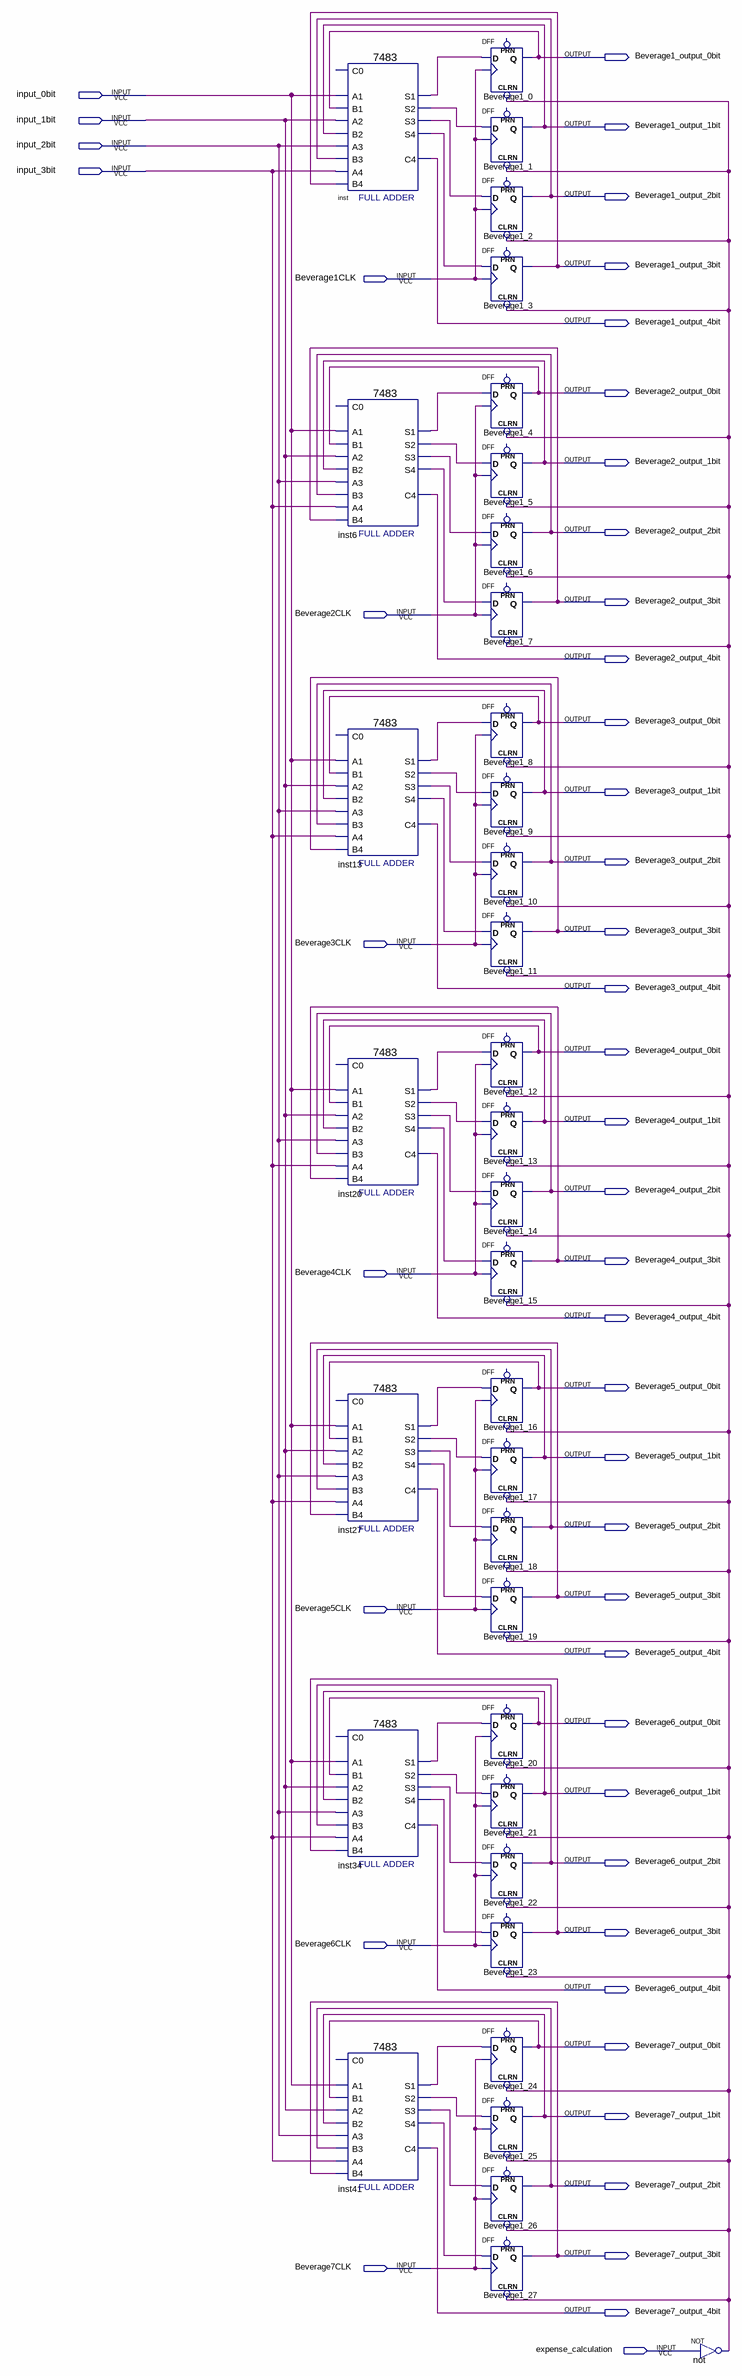
[diagram p0: schematic sheet]
// Quartus schematic DFF_select_Beverage.bdf as structural Verilog: 36 symbols, 47 pins
module DFF_select_Beverage (
  input  input_0bit,
  input  input_1bit,
  input  input_2bit,
  input  input_3bit,
  input  Beverage1CLK,
  input  Beverage2CLK,
  input  Beverage3CLK,
  input  Beverage4CLK,
  input  Beverage5CLK,
  input  Beverage6CLK,
  input  Beverage7CLK,
  input  expense_calculation,
  output Beverage1_output_0bit,
  output Beverage1_output_1bit,
  output Beverage1_output_2bit,
  output Beverage1_output_3bit,
  output Beverage1_output_4bit,
  output Beverage2_output_0bit,
  output Beverage2_output_1bit,
  output Beverage2_output_2bit,
  output Beverage2_output_3bit,
  output Beverage2_output_4bit,
  output Beverage3_output_0bit,
  output Beverage3_output_1bit,
  output Beverage3_output_2bit,
  output Beverage3_output_3bit,
  output Beverage3_output_4bit,
  output Beverage4_output_0bit,
  output Beverage4_output_1bit,
  output Beverage4_output_2bit,
  output Beverage4_output_3bit,
  output Beverage4_output_4bit,
  output Beverage5_output_0bit,
  output Beverage5_output_1bit,
  output Beverage5_output_2bit,
  output Beverage5_output_3bit,
  output Beverage5_output_4bit,
  output Beverage6_output_0bit,
  output Beverage6_output_1bit,
  output Beverage6_output_2bit,
  output Beverage6_output_3bit,
  output Beverage6_output_4bit,
  output Beverage7_output_0bit,
  output Beverage7_output_1bit,
  output Beverage7_output_2bit,
  output Beverage7_output_3bit,
  output Beverage7_output_4bit
);

  wire inst6_s1, inst6_s2, inst6_s3, inst6_s4, inst13_s1, inst13_s2, inst13_s3, inst13_s4, inst20_s1,
       inst20_s2, inst20_s3, inst20_s4, inst27_s1, inst27_s2, inst27_s3, inst27_s4, inst34_s1, inst34_s2,
       inst34_s3, inst34_s4, inst41_s1, inst41_s2, inst41_s3, inst41_s4, inst_s1, inst_s2, inst_s3, inst_s4,
       not_out;

  \7483  inst (
    .B4(Beverage1_output_3bit), .A1(input_0bit), .A2(input_1bit), .B1(Beverage1_output_0bit),
    .B2(Beverage1_output_1bit), .A3(input_2bit), .B3(Beverage1_output_2bit), .A4(input_3bit), .S3(inst_s3),
    .S4(inst_s4), .S2(inst_s2), .C4(Beverage1_output_4bit), .S1(inst_s1));  // open: C0
  \7483  inst6 (
    .B4(Beverage2_output_3bit), .A1(input_0bit), .A2(input_1bit), .B1(Beverage2_output_0bit),
    .B2(Beverage2_output_1bit), .A3(input_2bit), .B3(Beverage2_output_2bit), .A4(input_3bit), .S3(inst6_s3),
    .S4(inst6_s4), .S2(inst6_s2), .C4(Beverage2_output_4bit), .S1(inst6_s1));  // open: C0
  \7483  inst13 (
    .B4(Beverage3_output_3bit), .A1(input_0bit), .A2(input_1bit), .B1(Beverage3_output_0bit),
    .B2(Beverage3_output_1bit), .A3(input_2bit), .B3(Beverage3_output_2bit), .A4(input_3bit), .S3(inst13_s3),
    .S4(inst13_s4), .S2(inst13_s2), .C4(Beverage3_output_4bit), .S1(inst13_s1));  // open: C0
  \7483  inst20 (
    .B4(Beverage4_output_3bit), .A1(input_0bit), .A2(input_1bit), .B1(Beverage4_output_0bit),
    .B2(Beverage4_output_1bit), .A3(input_2bit), .B3(Beverage4_output_2bit), .A4(input_3bit), .S3(inst20_s3),
    .S4(inst20_s4), .S2(inst20_s2), .C4(Beverage4_output_4bit), .S1(inst20_s1));  // open: C0
  \7483  inst27 (
    .B4(Beverage5_output_3bit), .A1(input_0bit), .A2(input_1bit), .B1(Beverage5_output_0bit),
    .B2(Beverage5_output_1bit), .A3(input_2bit), .B3(Beverage5_output_2bit), .A4(input_3bit), .S3(inst27_s3),
    .S4(inst27_s4), .S2(inst27_s2), .C4(Beverage5_output_4bit), .S1(inst27_s1));  // open: C0
  \7483  inst34 (
    .B4(Beverage6_output_3bit), .A1(input_0bit), .A2(input_1bit), .B1(Beverage6_output_0bit),
    .B2(Beverage6_output_1bit), .A3(input_2bit), .B3(Beverage6_output_2bit), .A4(input_3bit), .S3(inst34_s3),
    .S4(inst34_s4), .S2(inst34_s2), .C4(Beverage6_output_4bit), .S1(inst34_s1));  // open: C0
  \7483  inst41 (
    .B4(Beverage7_output_3bit), .A1(input_0bit), .A2(input_1bit), .B1(Beverage7_output_0bit),
    .B2(Beverage7_output_1bit), .A3(input_2bit), .B3(Beverage7_output_2bit), .A4(input_3bit), .S3(inst41_s3),
    .S4(inst41_s4), .S2(inst41_s2), .C4(Beverage7_output_4bit), .S1(inst41_s1));  // open: C0
  DFF Beverage1_0 (.CLRN(not_out), .CLK(Beverage1CLK), .D(inst_s1), .Q(Beverage1_output_0bit));  // open: PRN
  DFF Beverage1_1 (.CLRN(not_out), .CLK(Beverage1CLK), .D(inst_s2), .Q(Beverage1_output_1bit));  // open: PRN
  DFF Beverage1_2 (.CLRN(not_out), .CLK(Beverage1CLK), .D(inst_s3), .Q(Beverage1_output_2bit));  // open: PRN
  DFF Beverage1_3 (.CLRN(not_out), .CLK(Beverage1CLK), .D(inst_s4), .Q(Beverage1_output_3bit));  // open: PRN
  DFF Beverage1_4 (.CLRN(not_out), .CLK(Beverage2CLK), .D(inst6_s1), .Q(Beverage2_output_0bit));  // open: PRN
  DFF Beverage1_5 (.CLRN(not_out), .CLK(Beverage2CLK), .D(inst6_s2), .Q(Beverage2_output_1bit));  // open: PRN
  DFF Beverage1_6 (.CLRN(not_out), .CLK(Beverage2CLK), .D(inst6_s3), .Q(Beverage2_output_2bit));  // open: PRN
  DFF Beverage1_7 (.CLRN(not_out), .CLK(Beverage2CLK), .D(inst6_s4), .Q(Beverage2_output_3bit));  // open: PRN
  DFF Beverage1_8 (.CLRN(not_out), .CLK(Beverage3CLK), .D(inst13_s1), .Q(Beverage3_output_0bit));  // open: PRN
  DFF Beverage1_9 (.CLRN(not_out), .CLK(Beverage3CLK), .D(inst13_s2), .Q(Beverage3_output_1bit));  // open: PRN
  DFF Beverage1_10 (.CLRN(not_out), .CLK(Beverage3CLK), .D(inst13_s3), .Q(Beverage3_output_2bit));  // open: PRN
  DFF Beverage1_11 (.CLRN(not_out), .CLK(Beverage3CLK), .D(inst13_s4), .Q(Beverage3_output_3bit));  // open: PRN
  DFF Beverage1_12 (.CLRN(not_out), .CLK(Beverage4CLK), .D(inst20_s1), .Q(Beverage4_output_0bit));  // open: PRN
  DFF Beverage1_13 (.CLRN(not_out), .CLK(Beverage4CLK), .D(inst20_s2), .Q(Beverage4_output_1bit));  // open: PRN
  DFF Beverage1_14 (.CLRN(not_out), .CLK(Beverage4CLK), .D(inst20_s3), .Q(Beverage4_output_2bit));  // open: PRN
  DFF Beverage1_15 (.CLRN(not_out), .CLK(Beverage4CLK), .D(inst20_s4), .Q(Beverage4_output_3bit));  // open: PRN
  DFF Beverage1_16 (.CLRN(not_out), .CLK(Beverage5CLK), .D(inst27_s1), .Q(Beverage5_output_0bit));  // open: PRN
  DFF Beverage1_17 (.CLRN(not_out), .CLK(Beverage5CLK), .D(inst27_s2), .Q(Beverage5_output_1bit));  // open: PRN
  DFF Beverage1_18 (.CLRN(not_out), .CLK(Beverage5CLK), .D(inst27_s3), .Q(Beverage5_output_2bit));  // open: PRN
  DFF Beverage1_19 (.CLRN(not_out), .CLK(Beverage5CLK), .D(inst27_s4), .Q(Beverage5_output_3bit));  // open: PRN
  DFF Beverage1_20 (.CLRN(not_out), .CLK(Beverage6CLK), .D(inst34_s1), .Q(Beverage6_output_0bit));  // open: PRN
  DFF Beverage1_21 (.CLRN(not_out), .CLK(Beverage6CLK), .D(inst34_s2), .Q(Beverage6_output_1bit));  // open: PRN
  DFF Beverage1_22 (.CLRN(not_out), .CLK(Beverage6CLK), .D(inst34_s3), .Q(Beverage6_output_2bit));  // open: PRN
  DFF Beverage1_23 (.CLRN(not_out), .CLK(Beverage6CLK), .D(inst34_s4), .Q(Beverage6_output_3bit));  // open: PRN
  DFF Beverage1_24 (.CLRN(not_out), .CLK(Beverage7CLK), .D(inst41_s1), .Q(Beverage7_output_0bit));  // open: PRN
  DFF Beverage1_25 (.CLRN(not_out), .CLK(Beverage7CLK), .D(inst41_s2), .Q(Beverage7_output_1bit));  // open: PRN
  DFF Beverage1_26 (.CLRN(not_out), .CLK(Beverage7CLK), .D(inst41_s3), .Q(Beverage7_output_2bit));  // open: PRN
  DFF Beverage1_27 (.CLRN(not_out), .CLK(Beverage7CLK), .D(inst41_s4), .Q(Beverage7_output_3bit));  // open: PRN
  not \not  (not_out, expense_calculation);
endmodule
